# EAGLE schematic 6309 CPU Card v2 (EAGLE 4.16)
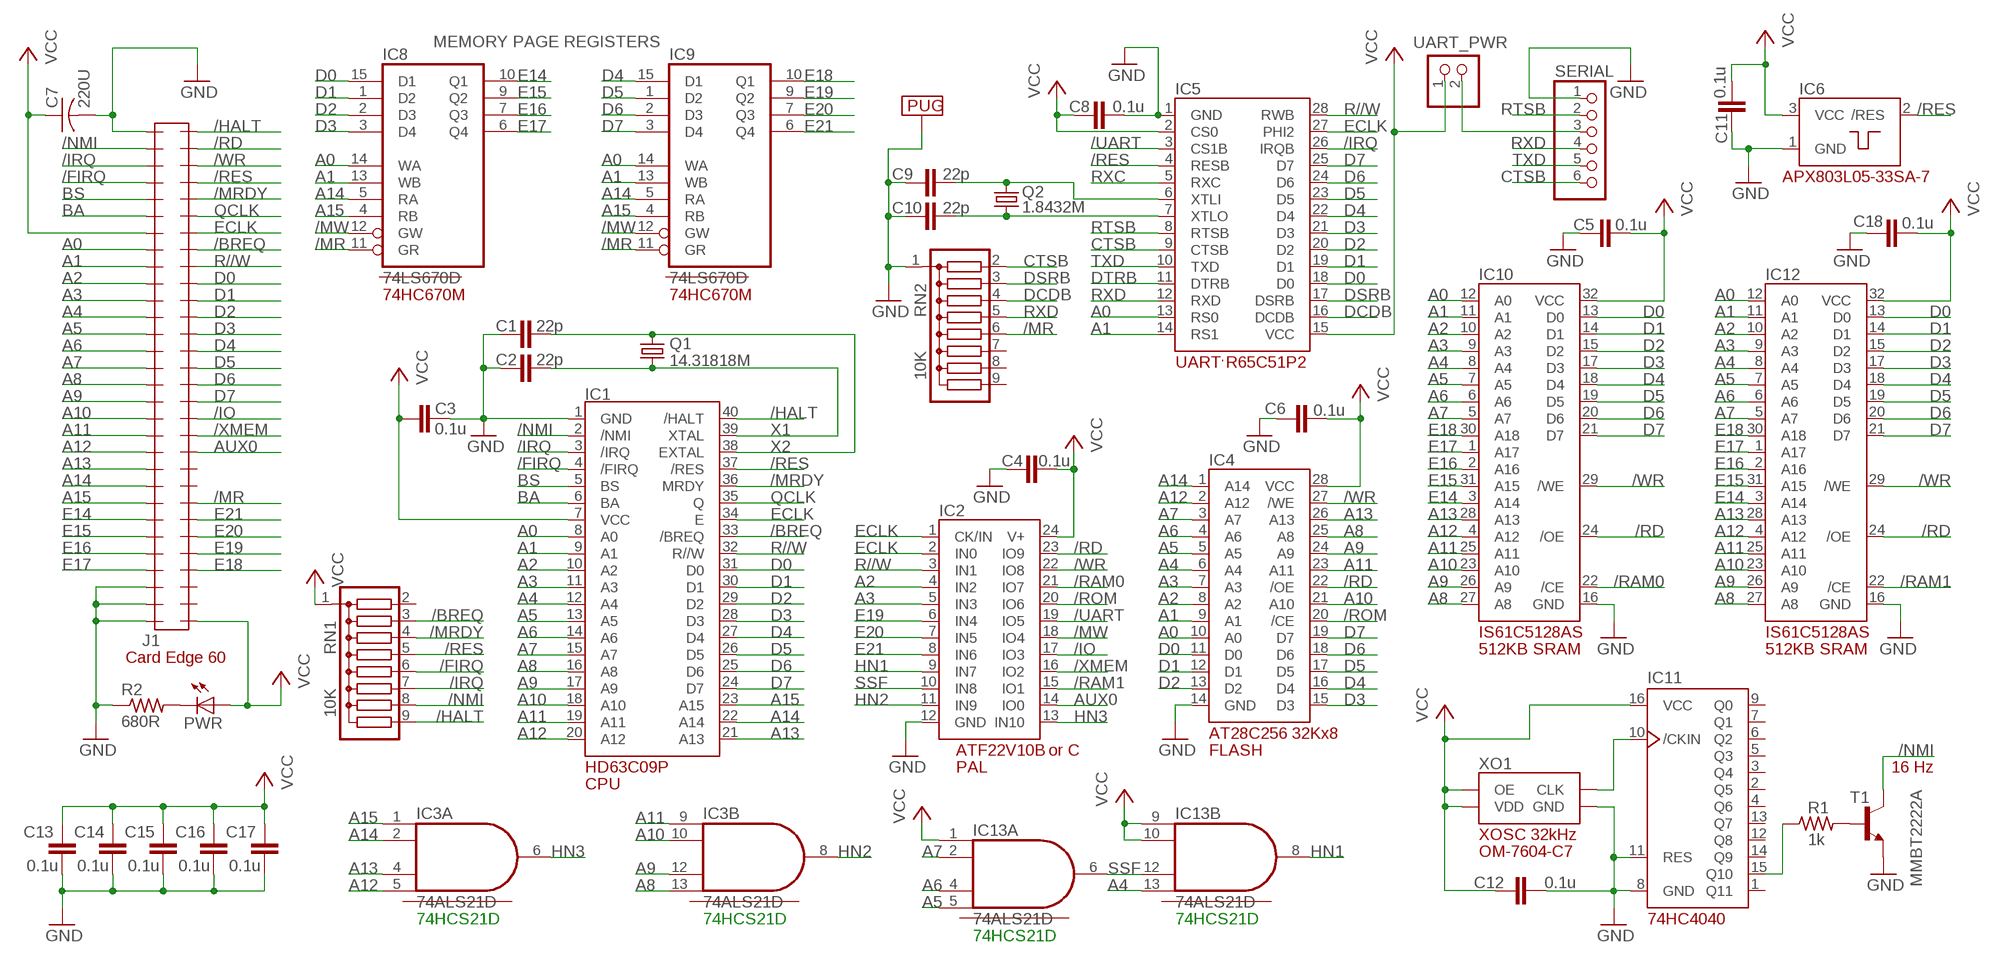
[diagram p0: schematic, sheet 1]

## Parts
C1  22p  C-EUC0603  [C0603]
C2  22p  C-EUC0603  [C0603]
C3  0.1u  C-EUC0603  [C0603]
C4  0.1u  C-EUC0603  [C0603]
C5  0.1u  C-EUC0603  [C0603]
C6  0.1u  C-EUC0603  [C0603]
C7  220U  C-US025-050X050  [C025-050X050]
C8  0.1u  C-EUC0603  [C0603]
C9  22p  C-EUC0603  [C0603]
C10  22p  C-EUC0603  [C0603]
C11  0.1u  C-EUC0603  [C0603]
C12  0.1u  C-EUC0603  [C0603]
C13  0.1u  C-EUC0603  [C0603]
C14  0.1u  C-EUC0603  [C0603]
C15  0.1u  C-EUC0603  [C0603]
C16  0.1u  C-EUC0603  [C0603]
C17  0.1u  C-EUC0603  [C0603]
C18  0.1u  C-EUC0603  [C0603]
IC1  HD63C09P  [DIL40]
IC2  PLD_ATF22V10B  [DIL24-3]
IC3  74ALS21D  [SO14]
IC4  EEP_32KX8_AT28C256  [DIL28-6]
IC5  UART_W65C51N  [DIL28-6]
IC6  POR_APX803L05-33SA-7  [SOT23]
IC8  74LS670D  [SO16]
IC9  74LS670D  [SO16]
IC10  IS61C5128AS  [SOIC32_11.3MM_WID]
IC11  74HC4040D  [SO16]
IC12  IS61C5128AS  [SOIC32_11.3MM_WID]
IC13  74ALS21D  [SO14]
J1  CARDEDGE_2.54_60POS  CARDEDGE_2.54_60POSEDGE  [CARDEDGE_2.54_60POS]
PWR  LED3MM  [LED3MM]
Q1  14.31818M  CRYSTALHC49S  [HC49/S]
Q2  1.8432M  CRYSTALHC49S  [HC49/S]
R1  1k  R-US_R0603  [R0603]
R2  680R  R-US_R0603  [R0603]
RN1  10K  G08R  [SIL9]
RN2  10K  G08R  [SIL9]
SERIAL  PINHD-1X6  [1X06]
T1  MMBT2222A  MMBT2222ALT1-NPN-SOT23-BEC  [SOT23-BEC]
U$2  PUG  [LARGE_PUG]
UART_PWR  PINHD-1X2  [1X02]
XO1  XODC_32KHZ_OM-7604-C7  [32K_XO_OM-7604-C7]

## Nets
/BREQ: IC1.33(/BREQ) J1.53 RN1.3
/FIRQ: IC1.4(/FIRQ) J1.4 RN1.6
/HALT: IC1.40(/HALT) J1.60 RN1.9
/IO: IC2.17(IO3) J1.43
/IRQ: IC1.3(/IRQ) IC5.26(IRQB) J1.3 RN1.7
/MR: IC8.11(GR) IC9.11(GR) J1.38 RN2.6
/MRDY: IC1.36(MRDY) J1.56 RN1.4
/MW: IC2.18(IO4) IC8.12(GW) IC9.12(GW)
/NMI: IC1.2(/NMI) J1.2 RN1.8 T1.C
/RAM0: IC2.21(IO7) IC10.22(/CE)
/RAM1: IC2.15(IO1) IC12.22(/CE)
/RD: IC2.23(IO9) IC4.22(/OE) IC10.24(/OE) IC12.24(/OE) J1.59
/RES: IC1.37(/RES) IC5.4(RESB) IC6.2(/RES) J1.57 RN1.5
/ROM: IC2.20(IO6) IC4.20(/CE)
/UART: IC2.19(IO5) IC5.3(CS1B)
/WR: IC2.22(IO8) IC4.27(/WE) IC10.29(/WE) IC12.29(/WE) J1.58
/XMEM: IC2.16(IO2) J1.42
A0: IC1.8(A0) IC4.10(A0) IC5.13(RS0) IC8.14(WA) IC9.14(WA) IC10.12(A0) IC12.12(A0) J1.8
A1: IC1.9(A1) IC4.9(A1) IC5.14(RS1) IC8.13(WB) IC9.13(WB) IC10.11(A1) IC12.11(A1) J1.9
A2: IC1.10(A2) IC2.4(IN2) IC4.8(A2) IC10.10(A2) IC12.10(A2) J1.10
A3: IC1.11(A3) IC2.5(IN3) IC4.7(A3) IC10.9(A3) IC12.9(A3) J1.11
A4: IC1.12(A4) IC4.6(A4) IC10.8(A4) IC12.8(A4) IC13.13(B:I3) J1.12
A5: IC1.13(A5) IC4.5(A5) IC10.7(A5) IC12.7(A5) IC13.5(A:I3) J1.13
A6: IC1.14(A6) IC4.4(A6) IC10.6(A6) IC12.6(A6) IC13.4(A:I2) J1.14
A7: IC1.15(A7) IC4.3(A7) IC10.5(A7) IC12.5(A7) IC13.2(A:I1) J1.15
A8: IC1.16(A8) IC3.13(B:I3) IC4.25(A8) IC10.27(A8) IC12.27(A8) J1.16
A9: IC1.17(A9) IC3.12(B:I2) IC4.24(A9) IC10.26(A9) IC12.26(A9) J1.17
A10: IC1.18(A10) IC3.10(B:I1) IC4.21(A10) IC10.23(A10) IC12.23(A10) J1.18
A11: IC1.19(A11) IC3.9(B:I0) IC4.23(A11) IC10.25(A11) IC12.25(A11) J1.19
A12: IC1.20(A12) IC3.5(A:I3) IC4.2(A12) IC10.4(A12) IC12.4(A12) J1.20
A13: IC1.21(A13) IC3.4(A:I2) IC4.26(A13) IC10.28(A13) IC12.28(A13) J1.21
A14: IC1.22(A14) IC3.2(A:I1) IC4.1(A14) IC8.5(RA) IC9.5(RA) J1.22
A15: IC1.23(A15) IC3.1(A:I0) IC8.4(RB) IC9.4(RB) J1.23
AUX0: IC2.14(IO0) J1.41
BA: IC1.6(BA) J1.6
BS: IC1.5(BS) J1.5
CTSB: IC5.9(CTSB) RN2.2 SERIAL.6
D0: IC1.31(D0) IC4.11(D0) IC5.18(D0) IC8.15(D1) IC10.13(D0) IC12.13(D0) J1.51
D1: IC1.30(D1) IC4.12(D1) IC5.19(D1) IC8.1(D2) IC10.14(D1) IC12.14(D1) J1.50
D2: IC1.29(D2) IC4.13(D2) IC5.20(D2) IC8.2(D3) IC10.15(D2) IC12.15(D2) J1.49
D3: IC1.28(D3) IC4.15(D3) IC5.21(D3) IC8.3(D4) IC10.17(D3) IC12.17(D3) J1.48
D4: IC1.27(D4) IC4.16(D4) IC5.22(D4) IC9.15(D1) IC10.18(D4) IC12.18(D4) J1.47
D5: IC1.26(D5) IC4.17(D5) IC5.23(D5) IC9.1(D2) IC10.19(D5) IC12.19(D5) J1.46
D6: IC1.25(D6) IC4.18(D6) IC5.24(D6) IC9.2(D3) IC10.20(D6) IC12.20(D6) J1.45
D7: IC1.24(D7) IC4.19(D7) IC5.25(D7) IC9.3(D4) IC10.21(D7) IC12.21(D7) J1.44
DCDB: IC5.16(DCDB) RN2.4
DSRB: IC5.17(DSRB) RN2.3
DTRB: IC5.11(DTRB)
E14: IC8.10(Q1) IC10.3(A14) IC12.3(A14) J1.24
E15: IC8.9(Q2) IC10.31(A15) IC12.31(A15) J1.25
E16: IC8.7(Q3) IC10.2(A16) IC12.2(A16) J1.26
E17: IC8.6(Q4) IC10.1(A17) IC12.1(A17) J1.27
E18: IC9.10(Q1) IC10.30(A18) IC12.30(A18) J1.34
E19: IC2.6(IN4) IC9.9(Q2) J1.35
E20: IC2.7(IN5) IC9.7(Q3) J1.36
E21: IC2.8(IN6) IC9.6(Q4) J1.37
ECLK: IC1.34(E) IC2.1(CK/IN) IC2.2(IN0) IC5.27(PHI2) J1.54
GND [supply]: C1.1 C2.1 C3.2 C4.1 C5.1 C6.1 C7.2 C8.2 C9.1 C10.1 C11.2 C12.2 C13.2 C14.2 C15.2 C16.2 C17.2 C18.1 IC1.1(GND) IC2.12(GND) IC4.14(GND) IC5.1(GND) IC6.1(GND) IC10.16(GND) IC11.8(GND) IC11.11(RES) IC12.16(GND) J1.1 J1.28 J1.29 J1.30 R2.1 RN2.1 SERIAL.1 T1.E U$2.P$1 XO1.GND
HN1: IC2.9(IN7) IC13.8(B:O)
HN2: IC2.11(IN9) IC3.8(B:O)
HN3: IC2.13(IN10) IC3.6(A:O)
N$1: R1.2 T1.B
N$2: PWR.K(C) R2.2
N$3: IC11.15(Q10) R1.1
N$4 [supply]: SERIAL.3 UART_PWR.2
N$5: IC11.10(/CKIN) XO1.CKOUT(CLK)
N$20: C9.2 IC5.6(XTLI) Q2.2
N$21: C10.2 IC5.7(XTLO) Q2.1
QCLK: IC1.35(Q) J1.55
R//W: IC1.32(R//W) IC2.3(IN1) IC5.28(RWB) J1.52
RTSB: IC5.8(RTSB) SERIAL.2
RXC: IC5.5(RXC)
RXD: IC5.12(RXD) RN2.5 SERIAL.4
SSF: IC2.10(IN8) IC13.6(A:O) IC13.12(B:I2)
TXD: IC5.10(TXD) SERIAL.5
VCC [supply]: C3.1 C4.2 C5.2 C6.2 C7.1 C8.1 C11.1 C12.1 C13.1 C14.1 C15.1 C16.1 C17.1 C18.2 IC1.7(VCC) IC2.24(V+) IC4.28(VCC) IC5.2(CS0) IC5.15(VCC) IC6.3(VCC) IC10.32(VCC) IC11.16(VCC) IC12.32(VCC) IC13.1(A:I0) IC13.9(B:I0) IC13.10(B:I1) J1.7 J1.31 PWR.A RN1.1 UART_PWR.1 XO1.OE XO1.VDD
X1: C2.2 IC1.39(XTAL) Q1.1
X2: C1.2 IC1.38(EXTAL) Q1.2
Unconnected: IC11.1(Q11) IC11.2(Q5) IC11.3(Q4) IC11.4(Q6) IC11.5(Q3) IC11.6(Q2) IC11.7(Q1) IC11.9(Q0) IC11.12(Q8) IC11.13(Q7) IC11.14(Q9) J1.32 J1.33 J1.39 J1.40 RN1.2 RN2.7 RN2.8 RN2.9

## Notes on the sheet
- MEMORY PAGE REGISTERS
- 74HC670M | 74HC670M
- 512KB SRAM | 512KB SRAM
- or C | FLASH
- PAL | 16 Hz
- CPU
- 74HCS21D | 74HCS21D | 74HCS21D
- 74HCS21D

## Power pins joined to a net without a drawn wire
GND: IC3.7(P:GND) IC8.8(GND) IC9.8(GND) IC13.7(P:GND)
VCC: IC3.14(P:VCC) IC8.16(VCC) IC9.16(VCC) IC13.14(P:VCC)

## Library data of the parts
C1-C6 C8-C18 = rcl:C-EU: CAPACITOR, European symbol
C7 = rcl:C-US: CAPACITOR, American symbol
IC1 = 07-Retrocomputing:HD63C09P
IC2 = 07-Retrocomputing:PLD_ATF22V10B
IC3 IC13 = 74xx-us:74*21: Dual 4-input AND gate
IC4 = 07-Retrocomputing:EEP_32KX8_AT28C256
IC5 = 07-Retrocomputing:UART_W65C51N
IC6 = 07-Retrocomputing:POR_APX803L05-33SA-7
IC8 IC9 = 74xx-us:74*670: 4 by 4 REGISTER FILES, 3-state
IC10 IC12 = 07-Retrocomputing:IS61C5128AS
IC11 = 07-Retrocomputing:74HC4040
J1 = 07-Retrocomputing:CARDEDGE_2.54_60POS
PWR = led:LED: LED OSRAM: - CHIPLED LG R971, LG N971, LY N971, LG Q971, LY Q971, LO R971, LY R971 LH N974, LH R974 LS Q976, LO Q976, LY Q976 LO Q996 - Hyper CHIPLED LW Q18S LB Q993, LB Q99A, LB R99A - SideLED LS A670, LO A670, LY A670, LG A670, LP A670 LB A673, LV A673, LT A673, LW A673 LH A674 LY A675 LS A676, LA A676, LO A676, LY A676, LW A676 LS A679, LY A679, LG A679 - Hyper Micro SIDELED® LS Y876, LA Y876, LO Y876, LY Y876 LT Y87S - SmartLED LW L88C, LW L88S LB L89C, LB L89S, LG L890 LS L89K, LO L89K, LY L89K LS L896, LA L896, LO L896, LY L896 - TOPLED LS T670, LO T670, LY T670, LG T670, LP T670 LSG T670, LSP T670, LSY T670, LOP T670, LYG T670 LG T671, LOG T671, LSG T671 LB T673, LV T673, LT T673, LW T673 LH T674 LS T676, LA T676, LO T676, LY T676, LB T676, LH T676, LSB T676, LW T676 LB T67C, LV T67C, LT T67C, LS T67K, LO T67K, LY T67K, LW E67C LS E67B, LA E67B, LO E67B, LY E67B, LB E67C, LV E67C, LT E67C LW T67C LS T679, LY T679, LG T679 LS T770, LO T770, LY T770, LG T770, LP T770 LB T773, LV T773, LT T773, LW T773 LH T774 LS E675, LA E675, LY E675, LS T675 LS T776, LA T776, LO T776, LY T776, LB T776 LHGB T686 LT T68C, LB T68C - Hyper Mini TOPLED® LB M676 - Mini TOPLED Santana® LG M470 LS M47K, LO M47K, LY M47K Source: http://www.osram.convergy.de - LUMILED® LXK2-PW12-R00, LXK2-PW12-S00, LXK2-PW14-U00, LXK2-PW14-V00 LXK2-PM12-R00, LXK2-PM12-S00, LXK2-PM14-U00 LXK2-PE12-Q00, LXK2-PE12-R00, LXK2-PE12-S00, LXK2-PE14-T00, LXK2-PE14-U00 LXK2-PB12-K00, LXK2-PB12-L00, LXK2-PB12-M00, LXK2-PB14-N00, LXK2-PB14-P00, LXK2-PB14-Q00 LXK2-PR12-L00, LXK2-PR12-M00, LXK2-PR14-Q00, LXK2-PR14-R00 LXK2-PD12-Q00, LXK2-PD12-R00, LXK2-PD12-S00 LXK2-PH12-R00, LXK2-PH12-S00 LXK2-PL12-P00, LXK2-PL12-Q00, LXK2-PL12-R00 Source: www.luxeon.com
Q1 Q2 = crystal:CRYSTAL: CRYSTAL
R1 R2 = rcl:R-US_: RESISTOR, American symbol
RN1 RN2 = resistor-sil:G08R: SIL RESISTOR
SERIAL = pinhead:PINHD-1X6: PIN HEADER
T1 = transistor:*-NPN-: NPN Transistror
U$2 = 07-Retrocomputing:PUG
UART_PWR = pinhead:PINHD-1X2: PIN HEADER
XO1 = 07-Retrocomputing:XODC_32KHZ_OM-7604-C7

## Net classes
0 default: width 0.203 mm, drill 0.203 mm, clearance 0.254 mm
1 supply: width 0.61 mm, drill 0.203 mm, clearance 0.305 mm